# EAGLE board EL1034v4 (EAGLE 7.7.0), part 1 of 2
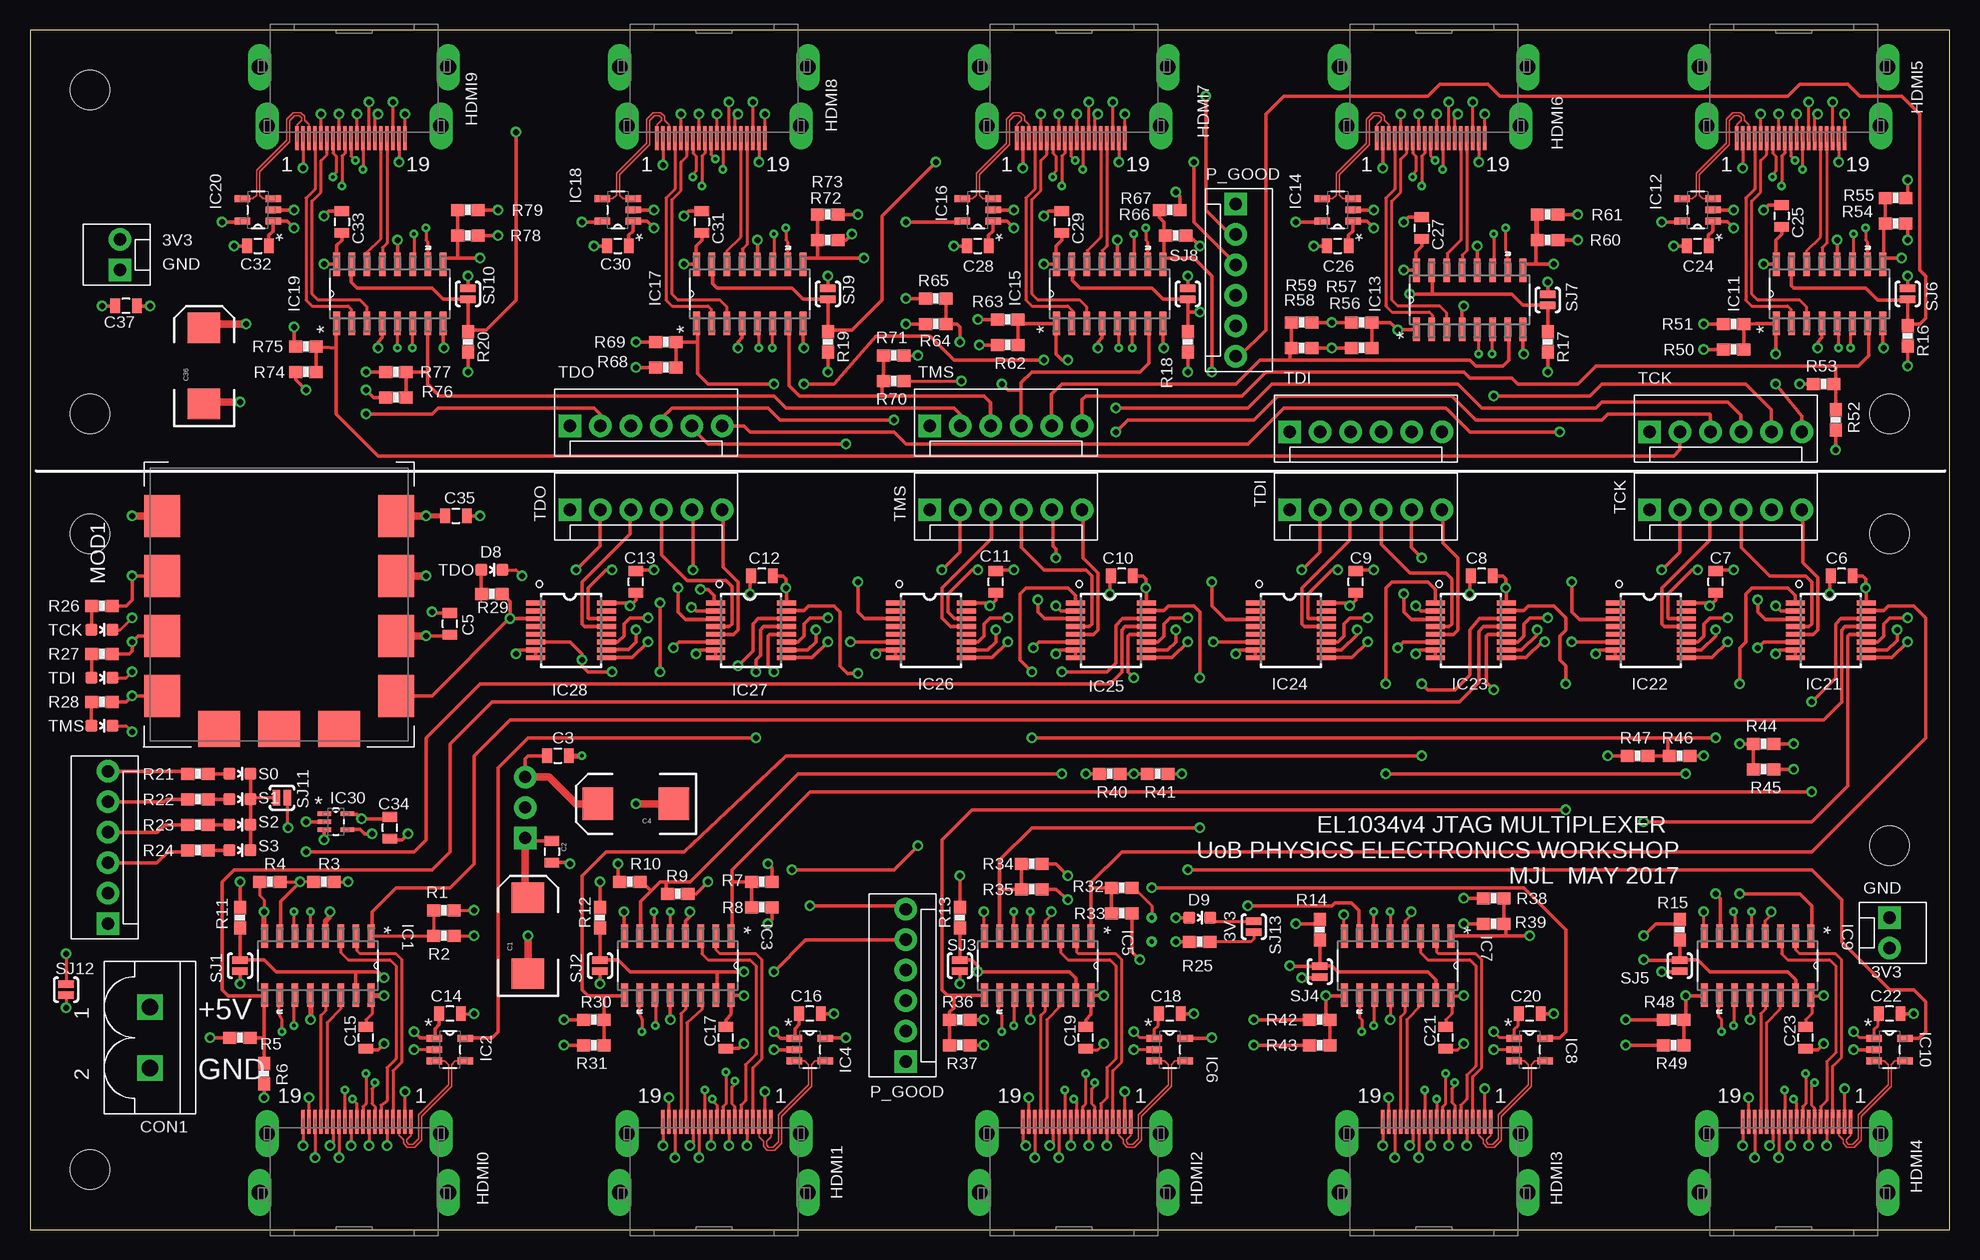
[diagram p7: board, top side]
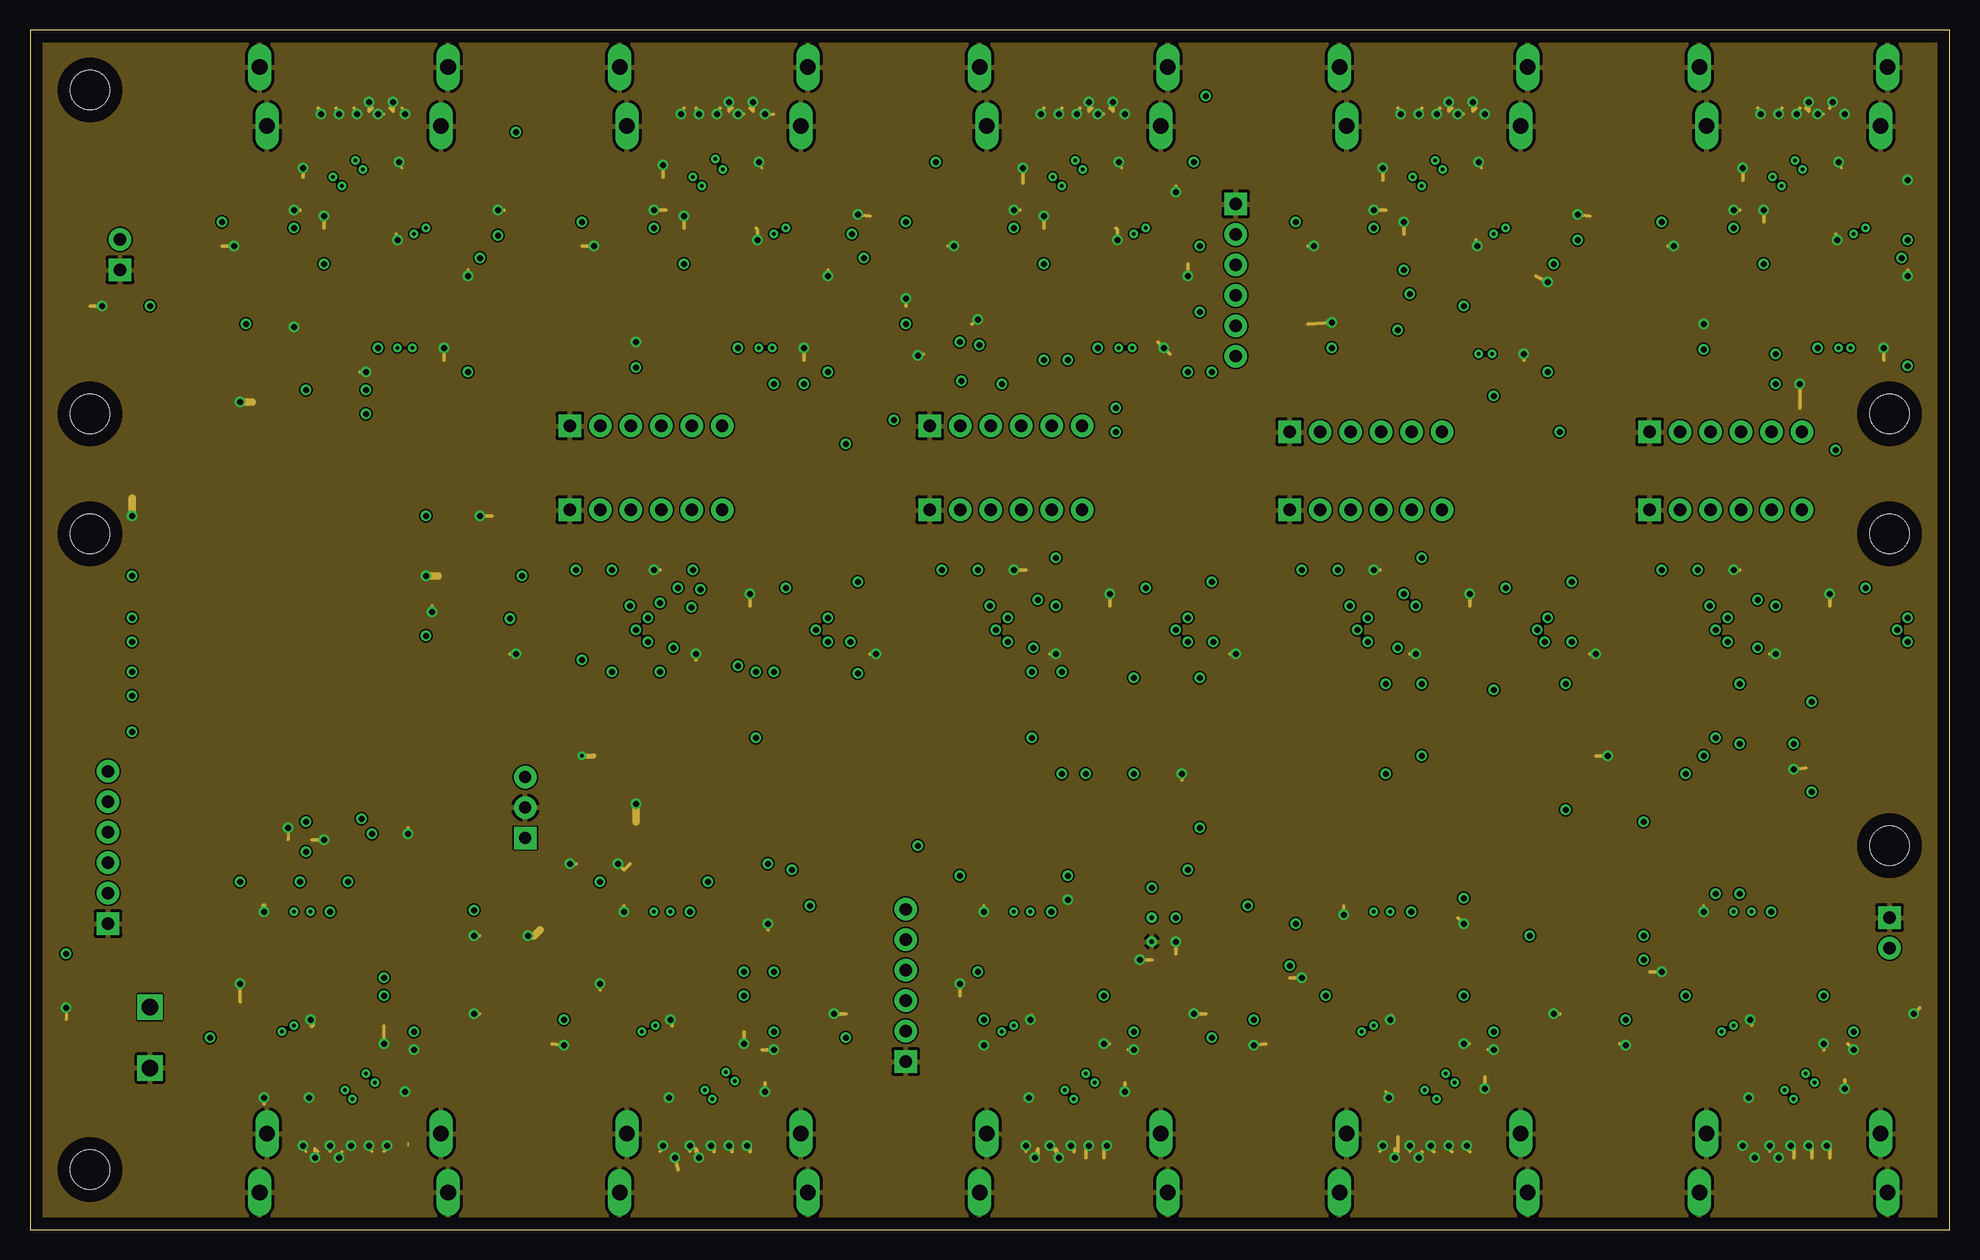
[diagram p8: board, inner layer GND]
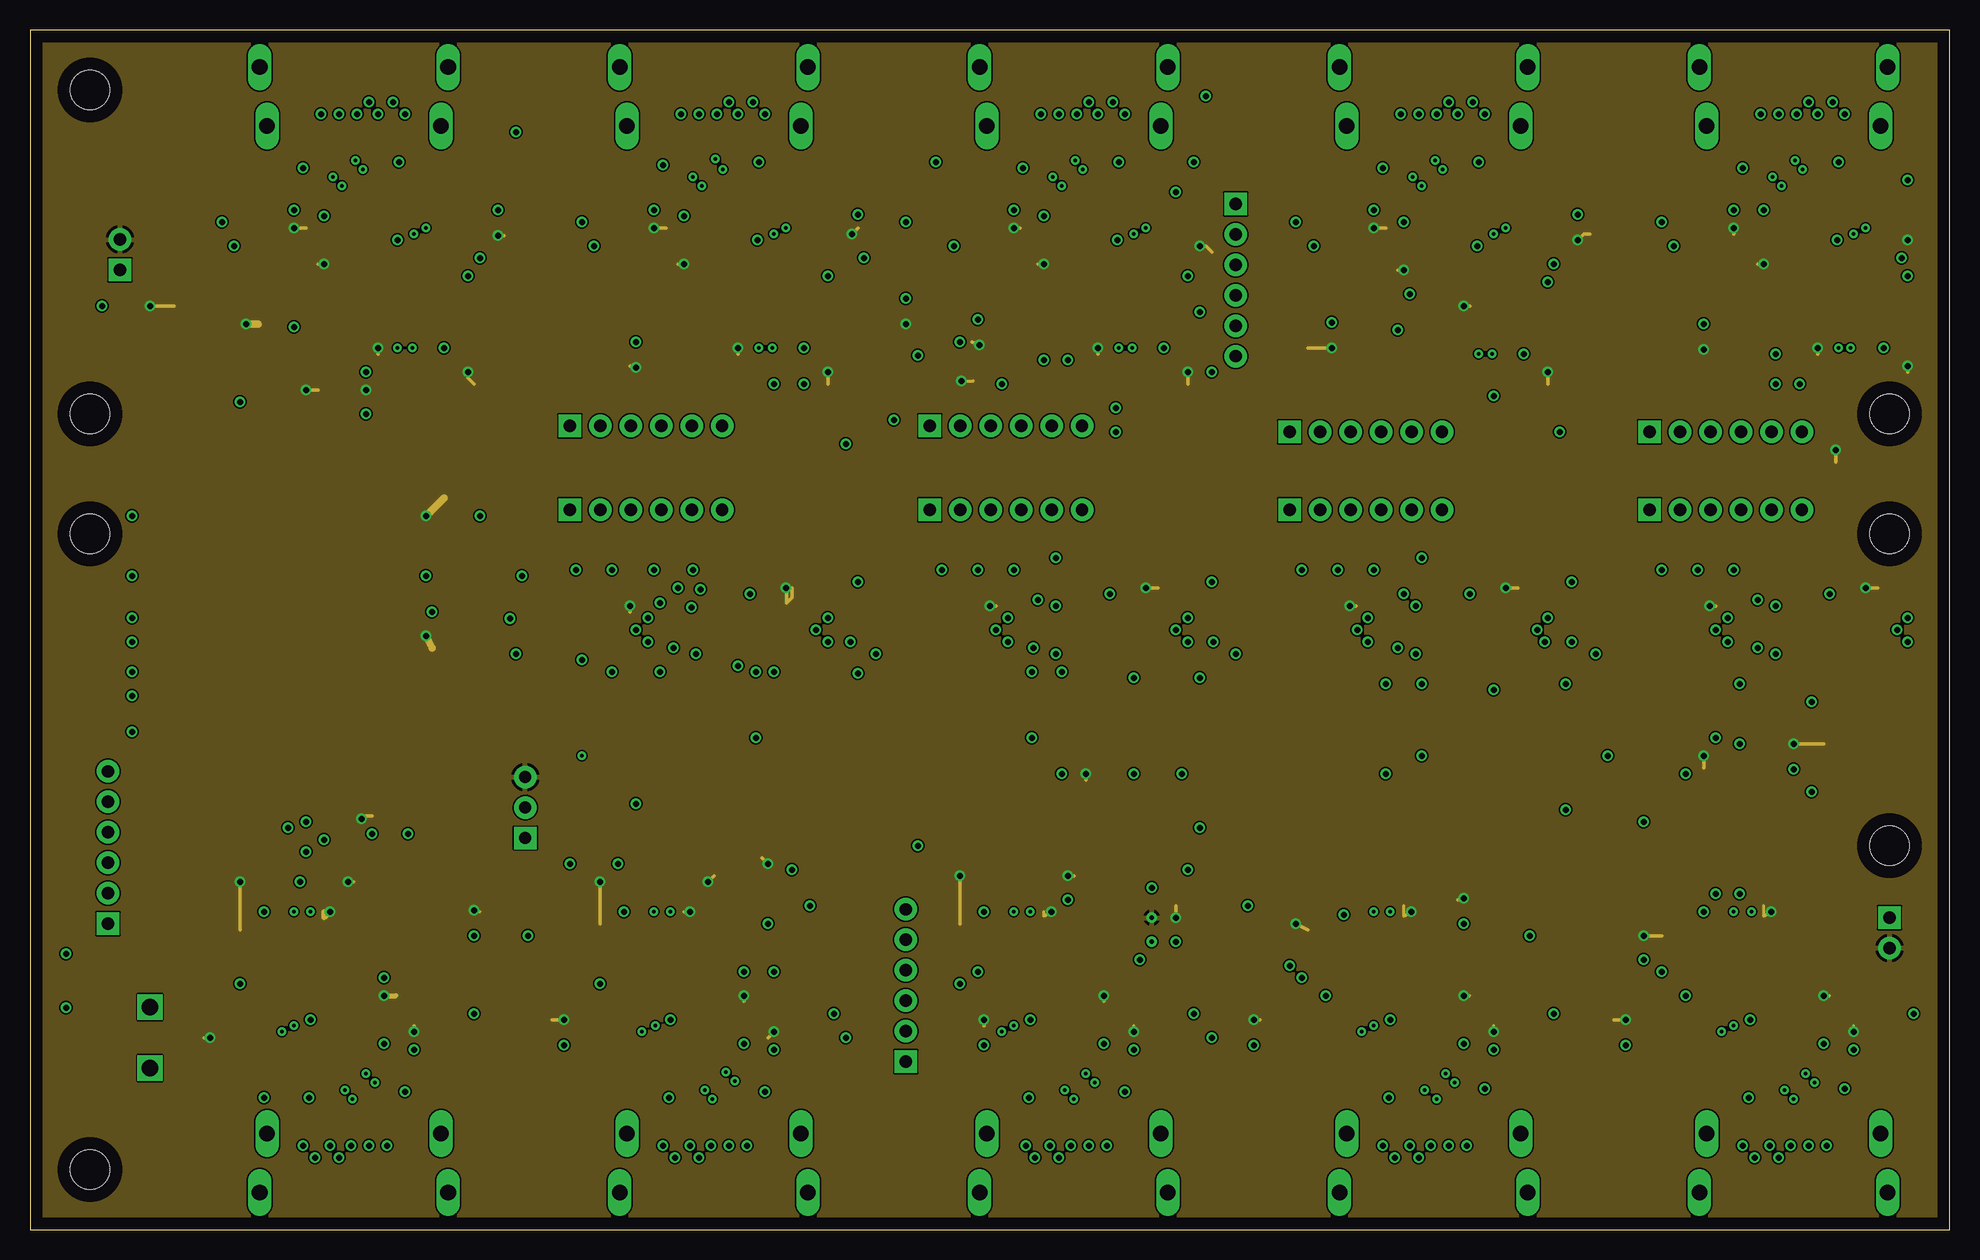
[diagram p9: board, inner layer 3.3V]
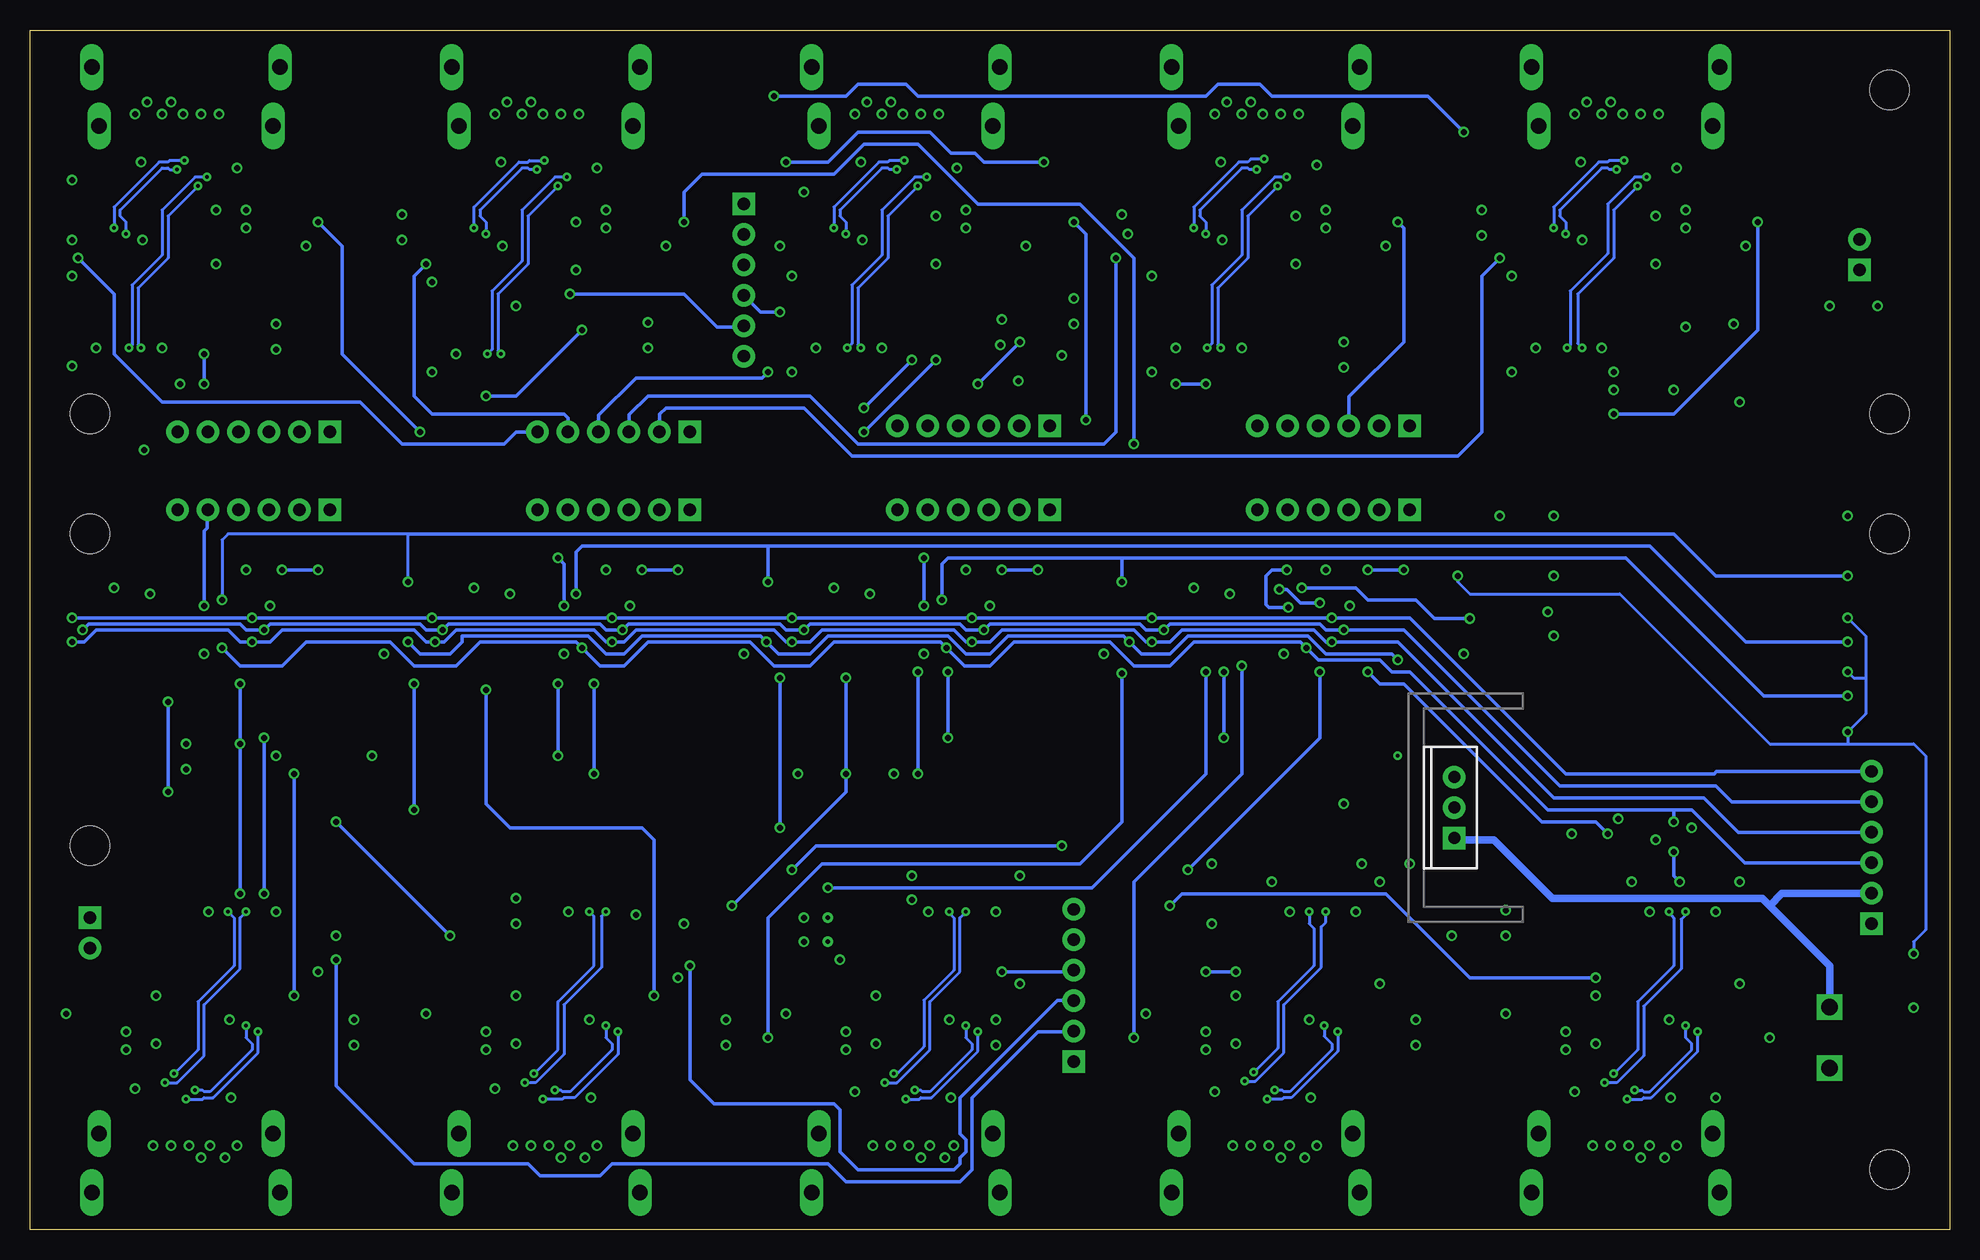
[diagram p10: board, bottom side, seen from below]

Size 160 x 100 mm. Coordinates in mm from the lower left corner, seen from the top.
Outline: 0,0 160,0 160,100 0,100 0,0
Copper layers (1*2*15*16): Top 0.035mm / dielectric 0.22mm / GND 0.035mm / dielectric 0.99mm / 3.3V 0.035mm / dielectric 0.22mm / Bottom 0.035mm
Design rules "PCBTrain_4_Layer": minimum track width 0.125mm, minimum drill 0.2mm, track to track 0.125mm, track to pad 0.125mm, pad to pad 0.125mm, via to via 0.125mm, smd to smd 0.125mm, copper to edge 40mil, drill to drill 8mil, minimum pad ring 10mil, minimum via ring 8mil, stop-mask expansion 0.125mm, vias tented up to drill 0mil, thermal gap 10mil

## Footprints (pad centres in the part's own frame; a part is rotated, then mirrored left to right if it is on the bottom)
EIA7343 = smd 2.55 x 2.7: A 3.17,0; C -3.17,0
0805 = smd 0.8 x 1.2: 1 -0.9,0; 2 0.9,0
SL5.08/2 = drill 1.4 square: P$1 -2.54,0; P$2 2.54,0
LED-0603 = smd 1 x 1: A 0,-0.877; C 0,0.877
47266-0001 = smd 0.3 x 2: 1 4.75,1; 2 4.25,1; 3 3.75,1; 4 3.25,1; 5 2.75,1; 6 2.25,1; 7 1.75,1; 8 1.25,1; 9 0.75,1; 10 0.25,1; 11 -0.25,1; 12 -0.75,1; 13 -1.25,1; 14 -1.75,1; 15 -2.25,1; 16 -2.75,1; 17 -3.25,1; 18 -3.75,1; 19 -4.25,1 | drill 1.3 long: SHELL1 7.25,0; SHELL2 -7.25,0; SHELL3 -7.85,-4.9; SHELL4 7.85,-4.9
SOIC127P600X175-16N = smd 1.981 x 0.559: 1 -2.464,4.445; 2 -2.464,3.175; 3 -2.464,1.905; 4 -2.464,0.635; 5 -2.464,-0.635; 6 -2.464,-1.905; 7 -2.464,-3.175; 8 -2.464,-4.445; 9 2.464,-4.445; 10 2.464,-3.175; 11 2.464,-1.905; 12 2.464,-0.635; 13 2.464,0.635; 14 2.464,1.905; 15 2.464,3.175; 16 2.464,4.445
SOT95P280X145-5N = smd 1.27 x 0.559: 1 -1.295,0.94; 2 -1.295,0; 3 -1.295,-0.94; 4 1.295,-0.94; 5 1.295,0.94
TSSOP16 = smd 0.4 x 1.6: 1 -2.225,-2.85; 2 -1.575,-2.85; 3 -0.925,-2.85; 4 -0.275,-2.85; 5 0.375,-2.85; 6 1.025,-2.85; 7 1.675,-2.85; 8 2.325,-2.85; 9 2.325,3.05; 10 1.675,3.05; 11 1.025,3.05; 12 0.375,3.05; 13 -0.275,3.05; 14 -0.925,3.05; 15 -1.575,3.05; 16 -2.225,3.05
TO220-IGO = drill 1 pad 1.88: GND 0,0; OUT 2.54,0 | drill 1 pad 1.88 square: IN -2.54,0
SOT65P210X110-5N = smd 1.118 x 0.356: 1 -0.965,0.66; 2 -0.965,0; 3 -0.965,-0.66; 4 0.965,-0.66; 5 0.965,0.66
MOLEX-1X6 = drill 1.016 pad 1.88 square: 1 0,0 | drill 1.016 pad 1.88: 2 2.54,0; 3 5.08,0; 4 7.62,0; 5 10.16,0; 6 12.7,0
MOLEX-1X2 = drill 1.016 pad 1.88 square: 1 0,0 | drill 1.016 pad 1.88: 2 2.54,0
JTAG_SMT2 = smd 3.5 x 3: 1 4,1; 2 9,1; 3 14,1; 4 19,1; 8 19,20.5; 9 14,20.5; 10 9,20.5; 11 4,20.5 | smd 3 x 3.5: 5 21.75,5.75; 6 21.75,10.75; 7 21.75,15.75
0603-RES = smd 1.1 x 1: 1 -0.85,0; 2 0.85,0
SJ_2S-NO = smd 0.635 x 1.27: 1 -0.45,0; 2 0.45,0
STAND-OFF = hole 3.302: 0,0
TP_15TH = drill 0.381 pad 0.61: P$1 0,0

## Placement (x,y rotation side)
C1  100u  [EIA7343]  41.5,24.5 90 top
C2  100n  [0805]  43.5,31.5 270 top
C3  100n  [0805]  44,39.5 0 top
C4  100u  [EIA7343]  50.5,35.5 180 top
C5  100n  [0805]  35,50.5 90 top
C6  100n  [0805]  151,54.5 180 top
C7  100n  [0805]  140.5,54 90 top
C8  100n  [0805]  121,54.5 180 top
C9  100n  [0805]  110.5,54 90 top
C10  100n  [0805]  91,54.5 180 top
C11  100n  [0805]  80.5,54 90 top
C12  100n  [0805]  61,54.5 180 top
C13  100n  [0805]  50.5,54 90 top
C14  100n  [0805]  35,18 180 top
C15  100n  [0805]  28,16 90 top
C16  100n  [0805]  65,18 180 top
C17  100n  [0805]  58,16 90 top
C18  100n  [0805]  95,18 180 top
C19  100n  [0805]  88,16 90 top
C20  100n  [0805]  125,18 180 top
C21  100n  [0805]  118,16 90 top
C22  100n  [0805]  155,18 180 top
C23  100n  [0805]  148,16 90 top
C24  100n  [0805]  139,82 0 top
C25  100n  [0805]  146,84.5 270 top
C26  100n  [0805]  109,82 0 top
C27  100n  [0805]  116,83.5 270 top
C28  100n  [0805]  79,82 0 top
C29  100n  [0805]  86,84 270 top
C30  100n  [0805]  49,82 0 top
C31  100n  [0805]  56,84 270 top
C32  100n  [0805]  19,82 0 top
C33  100n  [0805]  26,84 270 top
C34  100n  [0805]  30,33.5 90 top
C35  100n  [0805]  35.5,59.5 0 top
C36  100u  [EIA7343]  14.5,72 90 top
C37  100n  [0805]  8,77 180 top
CON1  SL5.08/2  [SL5.08/2]  10,16 270 top
D1  RED  [LED-0603]  17.5,38 270 top
D2  RED  [LED-0603]  17.5,35.88 270 top
D3  RED  [LED-0603]  17.5,33.75 270 top
D4  RED  [LED-0603]  17.5,31.62 270 top
D5  RED  [LED-0603]  6,50 270 top
D6  RED  [LED-0603]  6,46 270 top
D7  RED  [LED-0603]  6,42 270 top
D8  RED  [LED-0603]  38.5,55 270 top
D9  RED  [LED-0603]  97.5,26 270 top
HDMI0  47266-0001  [47266-0001]  27,8 0 top
HDMI1  47266-0001  [47266-0001]  57,8 0 top
HDMI2  47266-0001  [47266-0001]  87,8 0 top
HDMI3  47266-0001  [47266-0001]  117,8 0 top
HDMI4  47266-0001  [47266-0001]  147,8 0 top
HDMI5  47266-0001  [47266-0001]  147,92 180 top
HDMI6  47266-0001  [47266-0001]  117,92 180 top
HDMI7  47266-0001  [47266-0001]  87,92 180 top
HDMI8  47266-0001  [47266-0001]  57,92 180 top
HDMI9  47266-0001  [47266-0001]  27,92 180 top
IC1  DS90LV031ATMX  [SOIC127P600X175-16N]  24,22 270 top
IC2  SN65LVDT2DBVT  [SOT95P280X145-5N]  35,15 0 top
IC3  DS90LV031ATMX  [SOIC127P600X175-16N]  54,22 270 top
IC4  SN65LVDT2DBVT  [SOT95P280X145-5N]  65,15 0 top
IC5  DS90LV031ATMX  [SOIC127P600X175-16N]  84,22 270 top
IC6  SN65LVDT2DBVT  [SOT95P280X145-5N]  95,15 0 top
IC7  DS90LV031ATMX  [SOIC127P600X175-16N]  114,22 270 top
IC8  SN65LVDT2DBVT  [SOT95P280X145-5N]  125,15 0 top
IC9  DS90LV031ATMX  [SOIC127P600X175-16N]  144,22 270 top
IC10  SN65LVDT2DBVT  [SOT95P280X145-5N]  155,15 0 top
IC11  DS90LV031ATMX  [SOIC127P600X175-16N]  150,78 90 top
IC12  SN65LVDT2DBVT  [SOT95P280X145-5N]  139,85 180 top
IC13  DS90LV031ATMX  [SOIC127P600X175-16N]  120,77.5 90 top
IC14  SN65LVDT2DBVT  [SOT95P280X145-5N]  109,85 180 top
IC15  DS90LV031ATMX  [SOIC127P600X175-16N]  90,78 90 top
IC16  SN65LVDT2DBVT  [SOT95P280X145-5N]  79,85 180 top
IC17  DS90LV031ATMX  [SOIC127P600X175-16N]  60,78 90 top
IC18  SN65LVDT2DBVT  [SOT95P280X145-5N]  49,85 180 top
IC19  DS90LV031ATMX  [SOIC127P600X175-16N]  30,78 90 top
IC20  SN65LVDT2DBVT  [SOT95P280X145-5N]  19,85 180 top
IC21  74LV4051PW  [TSSOP16]  150,50 270 top
IC22  74LV4051PW  [TSSOP16]  135,50 270 top
IC23  74LV4051PW  [TSSOP16]  120,50 270 top
IC24  74LV4051PW  [TSSOP16]  105,50 270 top
IC25  74LV4051PW  [TSSOP16]  90,50 270 top
IC26  74LV4051PW  [TSSOP16]  75,50 270 top
IC27  74LV4051PW  [TSSOP16]  60,50 270 top
IC28  74LV4051PW  [TSSOP16]  45,50 270 top
IC29  LM3940  [TO220-IGO]  41.29,35.17 90 bottom
IC30  74LVC1G14SE-7  [SOT65P210X110-5N]  25.5,34 0 top
JP1  [MOLEX-1X6]  6.5,25.5 90 top
JP2  [MOLEX-1X6]  73,14 90 top
JP3  [MOLEX-1X6]  135,60 0 top
JP4  [MOLEX-1X6]  135,66.5 0 top
JP5  [MOLEX-1X6]  105,60 0 top
JP6  [MOLEX-1X6]  105,66.5 0 top
JP7  [MOLEX-1X6]  75,60 0 top
JP8  [MOLEX-1X6]  75,67 0 top
JP9  [MOLEX-1X6]  45,60 0 top
JP10  [MOLEX-1X6]  45,67 0 top
JP11  [MOLEX-1X6]  100.5,85.5 270 top
JP12  M02POLAR  [MOLEX-1X2]  7.5,80 90 top
JP13  M02POLAR  [MOLEX-1X2]  155,26 270 top
MOD1  JTAG-SMT2  [JTAG_SMT2]  10,63.5 270 top
R1  DNF  [0603-RES]  34.5,26.62 0 top
R2  100k  [0603-RES]  34.5,24.5 180 top
R3  DNF  [0603-RES]  24.5,29 0 top
R4  100k  [0603-RES]  20,29 0 top
R5  DNF  [0603-RES]  17.5,16 180 top
R6  100k  [0603-RES]  19.5,13 90 top
R7  DNF  [0603-RES]  61,29 0 top
R8  100k  [0603-RES]  61,26.88 180 top
R9  DNF  [0603-RES]  54,28 0 top
R10  100k  [0603-RES]  50,29 0 top
R11  10k  [0603-RES]  17.5,26 90 top
R12  10k  [0603-RES]  47.5,26 90 top
R13  10k  [0603-RES]  77.5,26 90 top
R14  10k  [0603-RES]  107.5,25 90 top
R15  10k  [0603-RES]  137.5,25 90 top
R16  10k  [0603-RES]  156.5,74.5 270 top
R17  10k  [0603-RES]  126.5,74 270 top
R18  10k  [0603-RES]  96.5,74 270 top
R19  10k  [0603-RES]  66.5,74 270 top
R20  10k  [0603-RES]  36.5,74 270 top
R21  2K2  [0603-RES]  14,38 180 top
R22  2K2  [0603-RES]  14,35.88 180 top
R23  2K2  [0603-RES]  14,33.75 180 top
R24  2K2  [0603-RES]  14,31.62 180 top
R25  2K2  [0603-RES]  97.5,24 0 top
R26  2K2  [0603-RES]  6,52 0 top
R27  2K2  [0603-RES]  6,48 0 top
R28  2K2  [0603-RES]  6,44 0 top
R29  2K2  [0603-RES]  38.5,53 0 top
R30  DNF  [0603-RES]  47,17.5 180 top
R31  100k  [0603-RES]  47,15.38 0 top
R32  DNF  [0603-RES]  91,28.5 0 top
R33  100k  [0603-RES]  91,26.38 180 top
R34  DNF  [0603-RES]  83.5,30.5 0 top
R35  100k  [0603-RES]  83.5,28.38 180 top
R36  DNF  [0603-RES]  77.5,17.5 0 top
R37  100k  [0603-RES]  77.5,15.38 180 top
R38  DNF  [0603-RES]  122,27.62 180 top
R39  100k  [0603-RES]  122,25.5 0 top
R40  DNF  [0603-RES]  90,38 180 top
R41  100k  [0603-RES]  94,38 180 top
R42  DNF  [0603-RES]  107.5,17.5 180 top
R43  100k  [0603-RES]  107.5,15.38 0 top
R44  DNF  [0603-RES]  144.5,40.5 0 top
R45  100k  [0603-RES]  144.5,38.38 180 top
R46  DNF  [0603-RES]  137.5,39.5 0 top
R47  100k  [0603-RES]  134,39.5 0 top
R48  DNF  [0603-RES]  137,17.5 180 top
R49  100k  [0603-RES]  137,15.38 0 top
R50  DNF  [0603-RES]  142,73.38 180 top
R51  100k  [0603-RES]  142,75.5 0 top
R52  DNF  [0603-RES]  150.5,67.5 270 top
R53  100k  [0603-RES]  149.5,70.5 0 top
R54  DNF  [0603-RES]  155.5,83.88 0 top
R55  100k  [0603-RES]  155.5,86 180 top
R56  DNF  [0603-RES]  111,73.5 180 top
R57  100k  [0603-RES]  111,75.62 0 top
R58  DNF  [0603-RES]  106,73.5 0 top
R59  100k  [0603-RES]  106,75.62 180 top
R60  DNF  [0603-RES]  126.5,82.5 0 top
R61  100k  [0603-RES]  126.5,84.62 180 top
R62  DNF  [0603-RES]  81.5,73.75 180 top
R63  100k  [0603-RES]  81.5,75.88 0 top
R64  DNF  [0603-RES]  75.5,75.5 180 top
R65  100k  [0603-RES]  75.5,77.62 0 top
R66  DNF  [0603-RES]  95.5,82.88 0 top
R67  100k  [0603-RES]  95,85 180 top
R68  DNF  [0603-RES]  53,71.88 180 top
R69  100k  [0603-RES]  53,74 0 top
R70  DNF  [0603-RES]  72,70.75 0 top
R71  100k  [0603-RES]  72,72.88 180 top
R72  DNF  [0603-RES]  66.5,82.5 0 top
R73  100k  [0603-RES]  66.5,84.62 180 top
R74  DNF  [0603-RES]  23,71.5 180 top
R75  100k  [0603-RES]  23,73.62 0 top
R76  DNF  [0603-RES]  30.5,69.38 180 top
R77  100k  [0603-RES]  30.5,71.5 0 top
R78  DNF  [0603-RES]  36.5,82.88 0 top
R79  100k  [0603-RES]  36.5,85 180 top
SJ1  SOLDERJUMPERNO  [SJ_2S-NO]  17.5,22 270 top
SJ2  SOLDERJUMPERNO  [SJ_2S-NO]  47.5,22 270 top
SJ3  SOLDERJUMPERNO  [SJ_2S-NO]  77.5,22 90 top
SJ4  SOLDERJUMPERNO  [SJ_2S-NO]  107.5,21.5 90 top
SJ5  SOLDERJUMPERNO  [SJ_2S-NO]  137.5,22 90 top
SJ6  SOLDERJUMPERNO  [SJ_2S-NO]  156.5,78 90 top
SJ7  SOLDERJUMPERNO  [SJ_2S-NO]  126.5,77.5 90 top
SJ8  SOLDERJUMPERNO  [SJ_2S-NO]  96.5,78 90 top
SJ9  SOLDERJUMPERNO  [SJ_2S-NO]  66.5,78 90 top
SJ10  SOLDERJUMPERNO  [SJ_2S-NO]  36.5,78 90 top
SJ11  SOLDERJUMPERNO  [SJ_2S-NO]  21,36 0 top
SJ12  SOLDERJUMPERNO  [SJ_2S-NO]  3,20 270 top
SJ13  SOLDERJUMPERNO  [SJ_2S-NO]  102,25.25 270 top
STANDOFF1  STAND-OFF  [STAND-OFF]  5,5 0 top
STANDOFF2  STAND-OFF  [STAND-OFF]  5,58 0 top
STANDOFF3  STAND-OFF  [STAND-OFF]  5,68 0 top
STANDOFF4  STAND-OFF  [STAND-OFF]  5,95 0 top
STANDOFF5  STAND-OFF  [STAND-OFF]  155,32 90 top
STANDOFF6  STAND-OFF  [STAND-OFF]  155,58 0 top
STANDOFF7  STAND-OFF  [STAND-OFF]  155,68 0 top
TP1  TEST-POINTTP_15TH_THRU  [TP_15TH]  93.5,26 0 top
TP2  TEST-POINTTP_15TH_THRU  [TP_15TH]  93.5,24 0 top